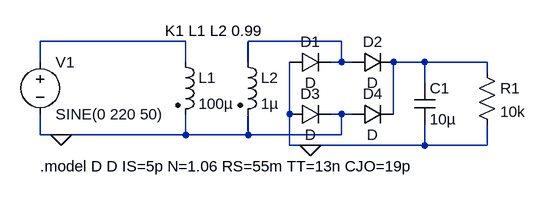
[diagram p0: schematic 2.1.asc]
2.1.asc, the LTspice schematic file:
Version 4
SHEET 1 1076 680
WIRE 320 80 96 80
WIRE 560 80 416 80
WIRE 96 112 96 80
WIRE 320 112 320 80
WIRE 416 112 416 80
WIRE 560 112 560 80
WIRE 560 112 544 112
WIRE 576 112 560 112
WIRE 688 112 640 112
WIRE 784 112 688 112
WIRE 784 128 784 112
WIRE 688 144 688 112
WIRE 480 192 480 112
WIRE 560 192 544 192
WIRE 576 192 560 192
WIRE 640 192 640 112
WIRE 96 224 96 192
WIRE 128 224 96 224
WIRE 320 224 320 192
WIRE 320 224 128 224
WIRE 416 224 416 192
WIRE 416 224 320 224
WIRE 560 224 560 192
WIRE 560 224 416 224
WIRE 480 240 480 192
WIRE 512 240 480 240
WIRE 688 240 688 208
WIRE 688 240 512 240
WIRE 784 240 784 208
WIRE 784 240 688 240
FLAG 128 224 0
FLAG 512 240 0
SYMBOL voltage 96 96 R0
WINDOW 123 0 0 Left 0
WINDOW 39 0 0 Left 0
SYMATTR InstName V1
SYMATTR Value SINE(0 220 50)
SYMBOL ind2 304 96 R0
SYMATTR InstName L1
SYMATTR Value 100µ
SYMATTR SpiceLine Rser=10m
SYMATTR Type ind
SYMBOL ind2 400 96 R0
SYMATTR InstName L2
SYMATTR Value 1µ
SYMATTR SpiceLine Rser=10m
SYMATTR Type ind
SYMBOL cap 672 144 R0
SYMATTR InstName C1
SYMATTR Value 10µ
SYMBOL res 768 112 R0
SYMATTR InstName R1
SYMATTR Value 10k
SYMBOL diode 480 128 R270
WINDOW 0 32 32 VTop 2
WINDOW 3 0 32 VBottom 2
SYMATTR InstName D1
SYMBOL diode 576 128 R270
WINDOW 0 32 32 VTop 2
WINDOW 3 0 32 VBottom 2
SYMATTR InstName D2
SYMBOL diode 480 208 R270
WINDOW 0 32 32 VTop 2
WINDOW 3 0 32 VBottom 2
SYMATTR InstName D3
SYMBOL diode 576 208 R270
WINDOW 0 32 32 VTop 2
WINDOW 3 0 32 VBottom 2
SYMATTR InstName D4
TEXT 96 272 Left 2 !.model D D IS=5p N=1.06 RS=55m TT=13n CJO=19p
TEXT 288 64 Left 2 !K1 L1 L2 0.99

The netlist it stands for:
* 2.1.asc
V1 N001 0 SINE(0 220 50)
L1 N001 0 100µ Rser=10m
L2 N002 0 1µ Rser=10m
C1 N003 0 10µ
R1 N003 0 10k
D1 0 N002 D
D2 N002 N003 D
D3 0 0 D
D4 0 N003 D
.model D D
.lib standard.dio
.model D D IS=5p N=1.06 RS=55m TT=13n CJO=19p
K1 L1 L2 0.99
.backanno
.end